# Altium schematic sheet Control.SchDoc: Control logic
size Letter; DrawnBy: Adam Gilbert; Engineer: J.-F. Cliche; DocumentNumber: 5; Revision: Rev0; SheetNumber: 5; SheetTotal: 5; ProjectTitle: DAN Squid Controller
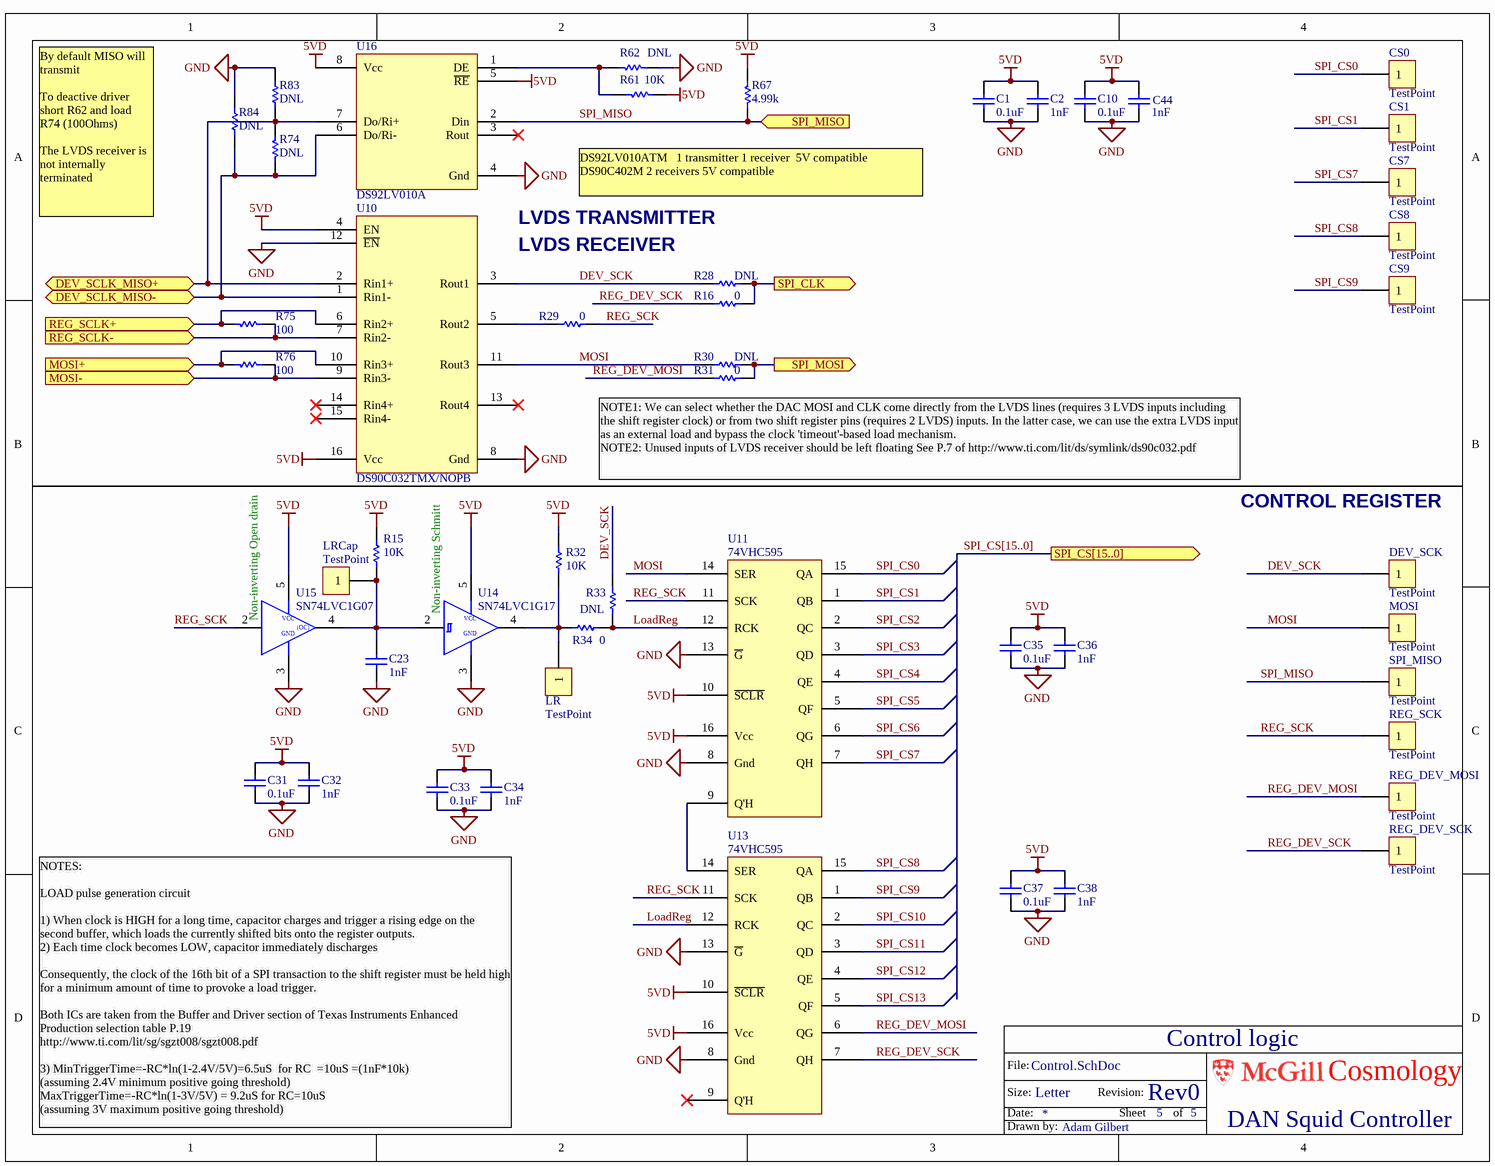
[diagram p0: Control.SchDoc]

## Parts
C1  0.1uF  [0603]
C2  1nF  [0603]
C10  0.1uF  [0603]
C23  1nF  [0603]
C31  0.1uF  [0603]
C32  1nF  [0603]
C33  0.1uF  [0603]
C34  1nF  [0603]
C35  0.1uF  [0603]
C36  1nF  [0603]
C37  0.1uF  [0603]
C38  1nF  [0603]
C44  1nF  [0603]
CS0  TestPoint  [TP-3520-SK]  (no BOM)
CS1  TestPoint  [TP-3520-SK]  (no BOM)
CS7  TestPoint  [TP-3520-SK]  (no BOM)
CS8  TestPoint  [TP-3520-SK]  (no BOM)
CS9  TestPoint  [TP-3520-SK]  (no BOM)
DEV_SCK  TestPoint  [TP-3520-SK]  (no BOM)
LR  TestPoint  [TP-3520-SK]  (no BOM)
LRCap  TestPoint  [TP-3520-SK]  (no BOM)
MOSI  TestPoint  [TP-3520-SK]  (no BOM)
R15  10k  [0603]
R16  0  [0603]
R28  DNL  [0603]
R29  0  [0603]
R30  DNL  [0603]
R31  0  [0603]
R32  10k  [0603]
R33  DNL  [0603]
R34  0  [0603]
R61  10k  [0603]
R62  DNL  [0603]
R67  4.99k  [0603]
R74  DNL  [0603]
R75  100  [0603]
R76  100  [0603]
R83  DNL  [0603]
R84  DNL  [0603]
REG_DEV_MOSI  TestPoint  [TP-3520-SK]  (no BOM)
REG_DEV_SCK  TestPoint  [TP-3520-SK]  (no BOM)
REG_SCK  TestPoint  [TP-3520-SK]  (no BOM)
SPI_MISO  TestPoint  [TP-3520-SK]  (no BOM)
U10  DS90C032TMX/NOPB  [SO16]
U11  74VHC595  [SO16]
U13  74VHC595  [SO16]
U14  SN74LVC1G17  [SOT23-5]
U15  SN74LVC1G07  [SOT23-5]
U16  DS92LV010A  [SO8]

## Ports
DEV_SCLK_MISO+ (bidir), DEV_SCLK_MISO- (bidir), MOSI+ (in), MOSI- (in), REG_SCLK+ (in), REG_SCLK- (in), SPI_CLK (out), SPI_CS[15..0] (out), SPI_MISO (in), SPI_MOSI (out)

## Nets
5VD: C1.2 C2.2 C10.2 C31.2 C32.2 C33.2 C34.2 C35.2 C36.2 C37.2 C38.2 C44.2 R15.2 R32.2 R61.2 R67.2 U10.4(EN) U10.16(Vcc) U11.10(~{SCLR}) U11.16(Vcc) U13.10(~{SCLR}) U13.16(Vcc) U14.5(Vcc) U15.5(Vcc) U16.5(~{RE}) U16.8(Vcc)
GND: C1.1 C2.1 C10.1 C23.1 C31.1 C32.1 C33.1 C34.1 C35.1 C36.1 C37.1 C38.1 C44.1 R62.2 R83.1 R84.1 U10.8(Gnd) U10.12(~{EN}) U11.8(Gnd) U11.13(~{G}) U13.8(Gnd) U13.13(~{G}) U14.3(Gnd) U15.3(Gnd) U16.4(Gnd)
DEV_SCK: DEV_SCK.1 R28.2 R33.1 U10.3(Rout1)
DEV_SCLK_MISO+: R74.2 R83.2 U10.2(Rin1+) U16.7(Do/Ri+) ; port DEV_SCLK_MISO+
DEV_SCLK_MISO-: R74.1 R84.2 U10.1(Rin1-) U16.6(Do/Ri-) ; port DEV_SCLK_MISO-
LoadReg: R33.2 R34.1 U11.12(RCK) U13.12(RCK)
MOSI: MOSI.1 R30.2 U10.11(Rout3) U11.14(SER)
MOSI+: R76.2 U10.10(Rin3+) ; port MOSI+
MOSI-: R76.1 U10.9(Rin3-) ; port MOSI-
REG_DEV_MOSI: R31.2 REG_DEV_MOSI.1 U13.6(QG)
REG_DEV_SCK: R16.2 REG_DEV_SCK.1 U13.7(QH)
REG_SCK: R29.1 REG_SCK.1 U11.11(SCK) U13.11(SCK) U15.2(A)
REG_SCLK+: R75.2 U10.6(Rin2+) ; port REG_SCLK+
REG_SCLK-: R75.1 U10.7(Rin2-) ; port REG_SCLK-
SPI_CLK: R16.1 R28.1 ; port SPI_CLK
SPI_CS0: CS0.1 U11.15(QA)
SPI_CS1: CS1.1 U11.1(QB)
SPI_CS2: U11.2(QC)
SPI_CS3: U11.3(QD)
SPI_CS4: U11.4(QE)
SPI_CS5: U11.5(QF)
SPI_CS6: U11.6(QG)
SPI_CS7: CS7.1 U11.7(QH)
SPI_CS8: CS8.1 U13.15(QA)
SPI_CS9: CS9.1 U13.1(QB)
SPI_CS10: U13.2(QC)
SPI_CS11: U13.3(QD)
SPI_CS12: U13.4(QE)
SPI_CS13: U13.5(QF)
SPI_MISO: R67.1 SPI_MISO.1 U16.2(Din) ; port SPI_MISO
SPI_MOSI: R30.1 R31.1 ; port SPI_MOSI
NetC23_2: C23.2 LRCap.1 R15.1 U14.2(A) U15.4(Y)
NetLR_1: LR.1 R32.1 R34.2 U14.4(Y)
NetR29_2: R29.2 U10.5(Rout2)
NetR61_1: R61.1 R62.1 U16.1(DE)
NetU11_9: U11.9(Q'H) U13.14(SER)

Not connected (* = marked no-connect by the designer): U10 13(Rout4)* 14(Rin4+)* 15(Rin4-)*; U13 9(Q'H)*; U16 3(Rout)*

## Buses and harness runs
bus SPI_CS[15..0] = port SPI_CS[15..0]

## Notes on the sheet
- By default MISO will transmit
  To deactive driver short R62 and load R74 (100Ohms)
  The LVDS receiver is not internally terminated
- LVDS TRANSMITTER
- DS92LV010ATM   1 transmitter 1 receiver  5V compatible
  DS90C402M 2 receivers 5V compatible
- (near U10) LVDS RECEIVER
- NOTE1: We can select whether the DAC MOSI and CLK come directly from the LVDS lines (requires 3 LVDS inputs including the shift register clock) or from two shift register pins (requires 2 LVDS) inputs. In the latter case, we can use the extra LVDS input as an external load and bypass the clock 'timeout'-based load mechanism.
  NOTE2: Unused inputs of LVDS receiver should be left floating See P.7 of http://www.ti.com/lit/ds/symlink/ds90c032.pdf
- CONTROL REGISTER
- (near U15) Non-inverting Open drain
- (near U14) Non-inverting Schmitt
- NOTES:
  LOAD pulse generation circuit
  1) When clock is HIGH for a long time, capacitor charges and trigger a rising edge on the second buffer, which loads the currently shifted bits onto the register outputs.
  2) Each time clock becomes LOW, capacitor immediately discharges
  Consequently, the clock of the 16th bit of a SPI transaction to the shift register must be held high for a minimum amount of time to provoke a load trigger.
  Both ICs are taken from the Buffer and Driver section of Texas Instruments Enhanced Production selection table P.19
  http://www.ti.com/lit/sg/sgzt008/sgzt008.pdf
  3) MinTriggerTime=-RC*ln(1-2.4V/5V)=6.5uS  for RC  =10uS =(1nF*10k)
  (assuming 2.4V minimum positive going threshold)
  MaxTriggerTime=-RC*ln(1-3V/5V) = 9.2uS for RC=10uS
  (assuming 3V maximum positive going threshold)
- File:
- Size:
- Date:
- Letter
- Revision:
- Sheet
- of
- Cosmology
- Drawn by:
- (in symbol 74LVC1G07) VCC; (OC); GND
- (in symbol 74LVC1G17) VCC; GND

## Library data of the parts
C1 C10 C31 C33 C35 C37 = Cap0603: Capacitor, Ceramic, 0603; Part Constraints: 0.1uF 16V 10% X7R; Manufacturer: Generic; Supplier 1: Digi-Key; Supplier Part Number 1: 399-1096-1-ND; Value: 0.1uF
C2 C23 C32 C34 C36 C38 C44 = Cap0603: Capacitor, Ceramic, 0603; Part Constraints: 1nF 50V 10% X7R 0603; Manufacturer: Generic; Value: 1nF; Supplier 1: Digi-Key; Supplier Part Number 1: 399-1082-1-ND
CS0 CS1 CS7-CS9 DEV_SCK LR LRCap MOSI REG_DEV_MOSI REG_DEV_SCK REG_SCK SPI_MISO = TestPoint: TestPoint1; Part constraints: DNL; Footprint: *; Techinf: *
R15 R32 R61 = RES 0603: Manufacturer: Generic; Part Constraints: RES 10.0K OHM 1/10W 1% 0603 SMD; Manufacturer Part Number 1: e.g CRCW0603 series; Value: 10K; Supplier 1: Digi-Key; Supplier Part Number 1: 541-10.0KHCT-ND
R16 R29 R31 R34 R62 = RES 0603: Manufacturer: Generic; Manufacturer Part Number 1: e.g CRCW0603 series; Part constraints: 0 1/10W 1% 100ppm/C 0603; Supplier 1: Digi-Key; Supplier Part Number 1: 541-0.0GCT-ND
  R16 R29 R31 R34: Value: 0
  R62: Value: DNL
R28 R30 R33 = RES 0603: Resistor; Manufacturer: Generic; Manufacturer Part Number 1: e.g CRCW0603 series; Tolerance: 1%; Power: 1/10W; TempCoef: 100ppm/C; Value: DNL; Part Constraints: DNL
R67 = Res0603: RES 0603; Manufacturer: Generic; Part constraints: RES 4.99K OHM 1/10W 1% 0603 SMD; Manufacturer Part Number 1: e.g CRCW0603 series; Value: 4.99k; Supplier 1: Digi-Key; Supplier Part Number 1: 541-4.99KHCT-ND
R74-R76 = RES 0603: Manufacturer: Generic; Manufacturer Part Number 1: e.g CRCW0603 series; Part constraints: RES 100 OHM 1/10W 1% 0603 SMD; Supplier 1: Digi-Key; Supplier Part Number 1: 541-100HCT-ND
  R74: Value: DNL
  R75 R76: Value: 100
R83 R84 = Res0603: RES 0603; Manufacturer: Generic; Manufacturer Part Number 1: e.g CRCW0603 series; Value: DNL; Part constraints: DNL
U10 = DS90C032TMX/NOPB: IC LINE RCVR LVDS QUAD 16-SOIC; Manufacturer: National Semiconductor; Number of Drivers/Receivers: 0/4; Voltage - Supply: 4.5 V ~ 5.5 V; RoHS: RoHS Compliant; Category: Integrated Circuits (ICs); Stock 1: 7314; Pricing 1: 1=3.23, 25=2.4884, 100=2.258, 250=2.0276, 500=1.7511, 1000=1.47461 (CAD); Type: Receiver; Protocol: LVDS; Mounting Type: Surface Mount; Package / Case: 16-SOIC (0.154", 3.90mm Width); Supplier Device Package: 16-SOIC N; Packaging: Cut Tape (CT); ComponentLink1URL: http://www.ti.com/lit/ds/symlink/ds90c032.pdf; ComponentLink1Description: http://www.ti.com/lit/ds/symlink/ds90c032.pdf; Supplier 1: Digi-Key; Supplier Part Number 1: DS90C032TMXCT-ND; Part Constraints: DS90C032TMX/NOPB
U11 U13 = 74VHC595: IC SHIFT REGISTER 8BIT 16-SOIC; Manufacturer: Fairchild Semiconductor; Output Type: Standard; Number of Elements: 1; Number of Bits per Element: 8; Function: Serial to Parallel; Voltage - Supply: 2 V ~ 5.5 V; RoHS: RoHS Compliant; Category: Integrated Circuits (ICs); Stock 1: 53604; Pricing 1: 1=0.53, 10=0.427, 25=0.374, 100=0.3205, 250=0.2768, 500=0.23796, 1000=0.18453 (CAD); Logic Type: Shift Register; Operating Temperature: -40°C ~ 85°C; Mounting Type: Surface Mount; Package / Case: 16-SOIC (0.154", 3.90mm Width); Supplier Device Package: 16-SOIC; Packaging: Cut Tape (CT); ComponentLink1URL: http://www.fairchildsemi.com/ds/74/74VHC595.pdf; ComponentLink1Description: http://www.fairchildsemi.com/ds/74/74VHC595.pdf; Supplier 1: Digi-Key; Supplier Part Number 1: 568-9028-1-ND; Supplier 2: Digi-Key; Supplier Part Number 2: 74VHC595MXCT-ND; Part Constraints: 74VHC595
U14 = 74LVC1G17: Single Schmitt-Trigger buffer; Manufacturer: Texas Instruments; Part Constraints: SN74LVC1G17MDBVREP; Description: IC BUFFER SCHMIT TRIG SOT235; Logic Type: Schmitt Trigger - Buffer, Driver; Number of Elements: 1; Current - Output High, Low: 32mA, 32mA; Voltage - Supply: 1.65 V ~ 5.5 V; RoHS: RoHS Compliant; Category: Integrated Circuits (ICs); Stock 1: 19444; Pricing 1: 1=0.1, 10=0.084, 25=0.0748, 100=0.0505, 250=0.04948, 500=0.04856, 750=0.04763 (CAD); Number of Bits per Element: 1; Operating Temperature: -40°C ~ 85°C; Mounting Type: Surface Mount; Supplier Device Package: SOT-23-5; Packaging: Cut Tape (CT); ComponentLink1URL: http://www.ti.com/lit/ds/symlink/sn74lvc1g17.pdf; ComponentLink1Description: http://www.ti.com/lit/ds/symlink/sn74lvc1g17.pdf; Supplier 1: Digi-Key; Supplier Part Number 1: 296-11933-1-ND
U15 = 74LVC1G07: Single  NON-INVERTING BUFFER, Open Drain; PartNumber: SN74LVC1G07DBVR; Manufacturer: Texas Instruments; Supplier 1: Digi-Key; Supplier Part Number 1: 296-8485-1-ND; Part Constraints: SN74LVC1G07DBVR
U16 = DS92LV010A: IC TXRX BUS LVDS SINGLE 8-SOI; Manufacturer: National Semiconductor; Supplier 1: Newark; Supplier Part Number 1: 41K2108; Part Constraints: DS92LV010A